# EAGLE design LB_BIT_o6_BUZZER-v02(rev1) (EAGLE 6.6.0)
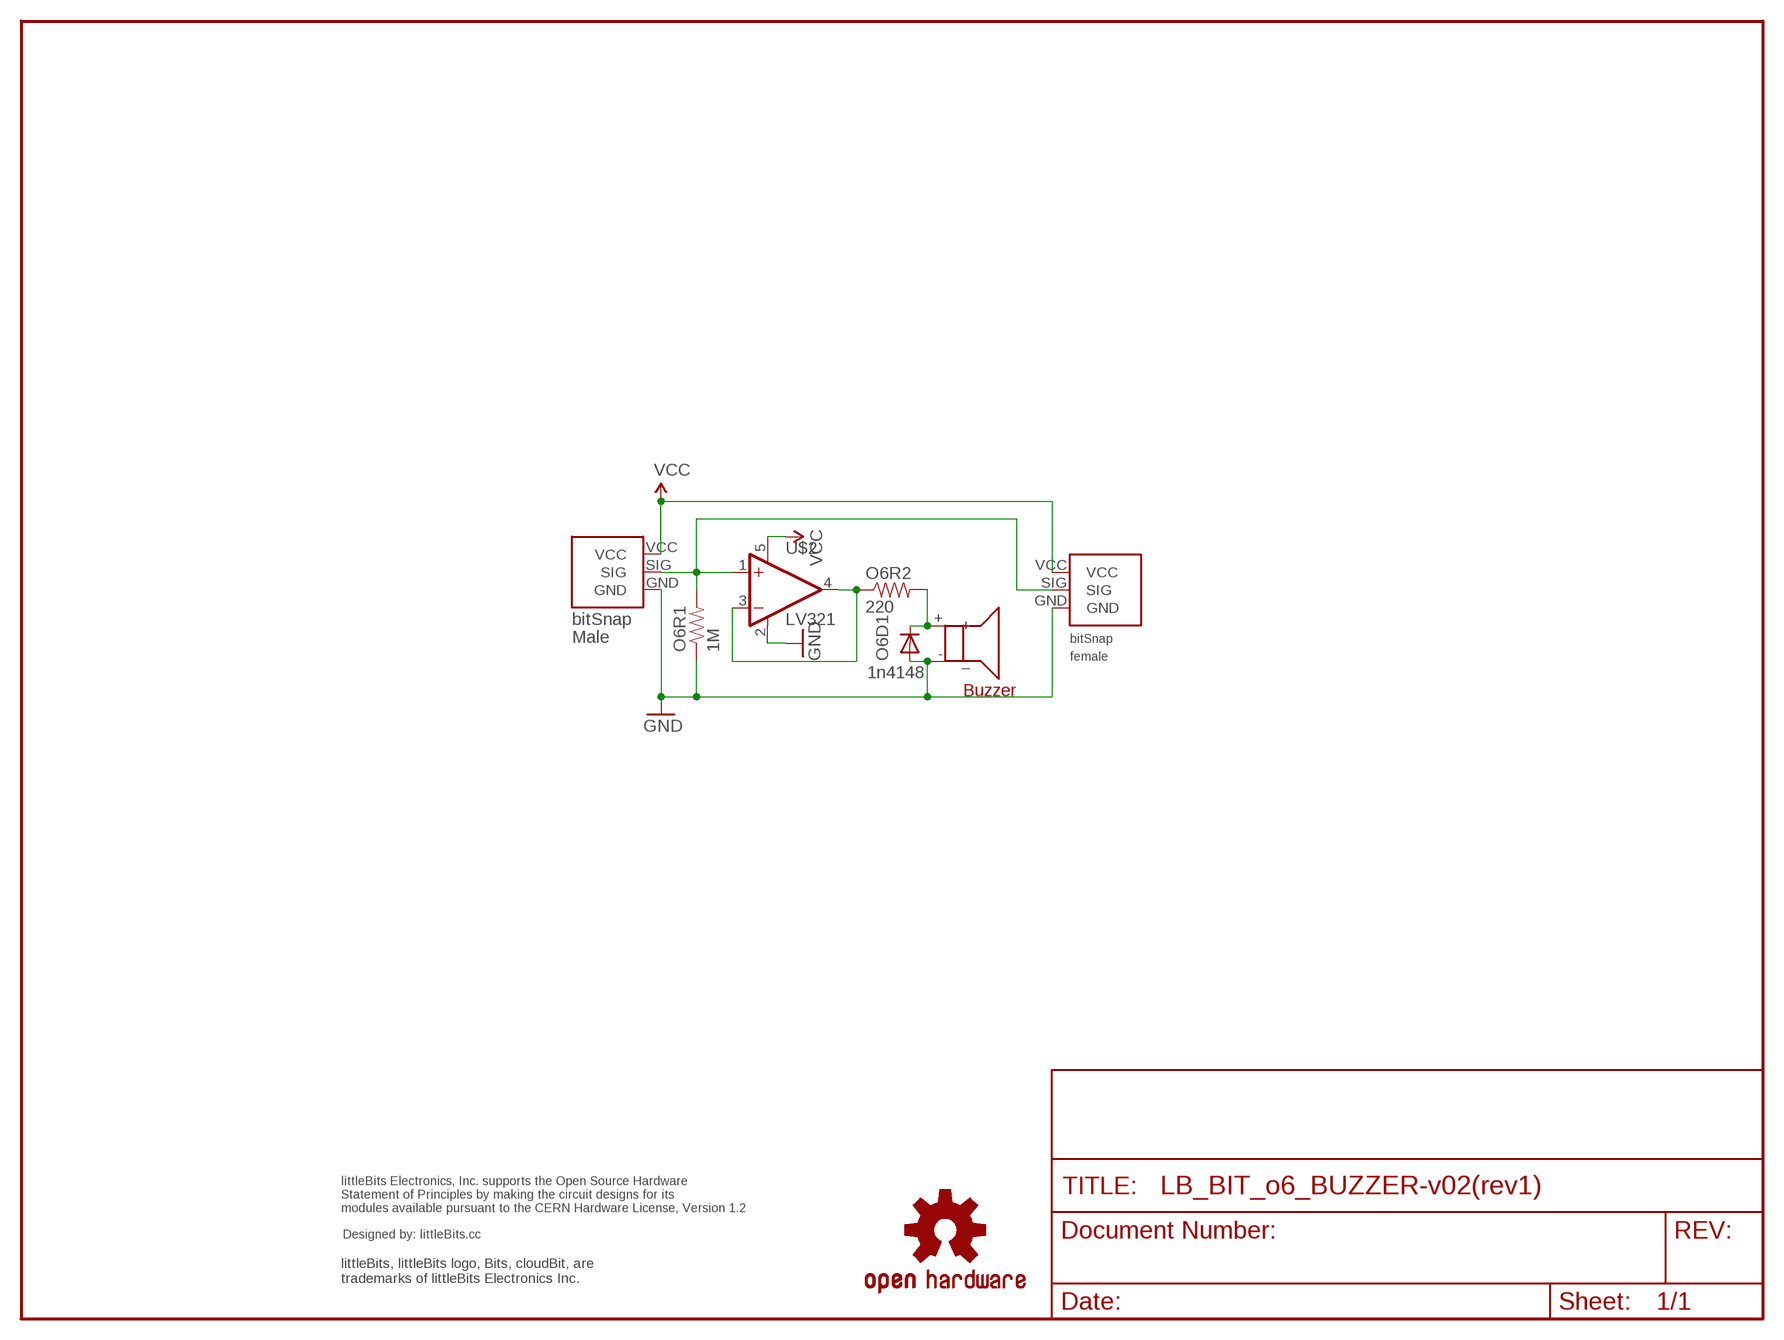
[diagram p0: schematic, sheet 1]

## Parts
O6BSF  BITSNAP_FEMALE  [BITSNAP_FEMALE]
O6BSM  BITSNAP_MALE  [BITSNAP_MALE]
O6D1  1n4148  DIODESOD  [SOD-323]
O6R1  1M  RESISTOR0603-RES  [0603-RES]
O6R2  220  RESISTOR0603-RES  [0603-RES]
O6U1  BUZZER-JSH2317AT  [BUZZER-JSH2317AT]
U$1  OSHWCREDIT  [OSHWCREDIT]
U$2  LV321  [SC70-5]
U$16  OSHW-LOGOL  [OSHW-LOGO-L]

## Nets
GND: O6BSF.GND O6BSM.GND O6D1.2(A) O6R1.1 O6U1.-(_) U$2.2(V-)
N$2: O6D1.1(C) O6R2.2 O6U1.+
N$6: O6BSF.SIG O6BSM.SIG O6R1.2 U$2.1(+IN)
N$8: O6R2.1 U$2.3(-IN) U$2.4(OUT)
VCC: O6BSF.VCC O6BSM.VCC U$2.5(V+)

## Library data of the parts
O6BSF = bitSnap:BITSNAP_FEMALE
O6BSM = bitSnap:BITSNAP_MALE
O6D1 = LITTLEBITS:DIODE: Diode These are standard reverse protection diodes and small signal diodes. SMA package can handle up to about 1A. SOD-323 can handle about 200mA. What the SOD-323 package when ordering, there are some mfgs out there that are 5-pin packages.
O6R1 O6R2 = SparkFun:RESISTOR: Resistor Basic schematic elements and footprints for 0603, 1206, and PTH 1/10th watt (small) resistors.
O6U1 = LITTLEBITS:BUZZER-JSH2317AT
U$1 = LITTLEBITS:OSHWCREDIT
U$2 = LITTLEBITS:LV321
U$16 = SparkFun_NEW:OSHW-LOGO: Open Source Hardware Logo This logo indicates the piece of hardware it is found on incorporates a OSHW license and/or adheres to the definition of open source hardware found here: http://freedomdefined.org/OSHW

## Board
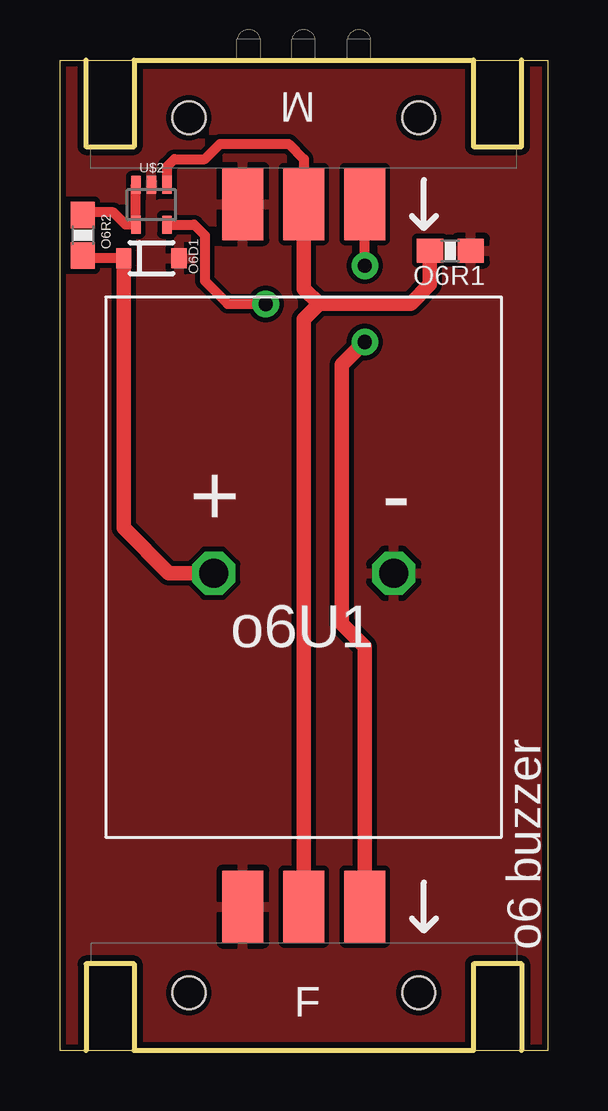
[diagram p1: board, top side]
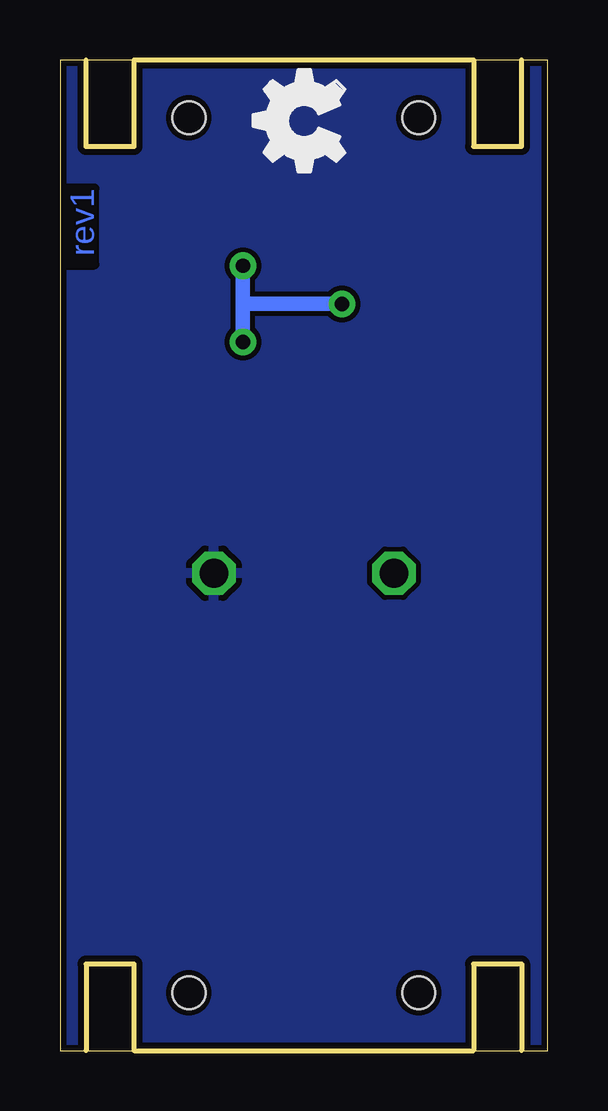
[diagram p2: board, bottom side, seen from below]

Size 20.32 x 41.27 mm. Coordinates in mm from the lower left corner, seen from the top.
Outline: 0,0 0,41.27 20.32,41.27 20.32,0 0,0
Copper layers (1*16): Top 0.035mm / dielectric 1.5mm / Bottom 0.035mm
Design rules "default": minimum track width 8mil, minimum drill 20mil, track to track 8mil, track to pad 8mil, pad to pad 8mil, via to via 8mil, smd to smd 8mil, copper to edge 10mil, drill to drill 8mil, minimum pad ring 12mil, minimum via ring 10mil, stop-mask expansion 4mil, vias tented up to drill 25mil, thermal gap 10mil

### Footprints (pad centres in the part's own frame; a part is rotated, then mirrored left to right if it is on the bottom)
BITSNAP_FEMALE = smd 1.7 x 3: GND 6.35,6; SIG 8.89,6; VCC 11.43,6 | hole 1.37: 13.68,2.41; 4.1,2.41
BITSNAP_MALE = smd 1.7 x 3: GND 11.43,6; SIG 8.89,6; VCC 6.35,6 | hole 1.37: 13.68,2.41; 4.1,2.41
SOD-323 = smd 0.63 x 0.83: 1 -1.15,0; 2 1.15,0
0603-RES = smd 1.1 x 1: 1 -0.85,0; 2 0.85,0
BUZZER-JSH2317AT = drill 1.2 octagon: + 4.5,11; - 12,11
SC70-5 = smd 0.4 x 0.75: 1 -0.65,-0.825; 2 0,-0.825; 3 0.65,-0.825; 4 0.65,0.825; 5 -0.65,0.825

### Placement (x,y rotation side)
O6BSF  1.27,0 0 top
O6BSM  19.05,41.27 180 top
O6D1  3.81,33.02 0 top
O6R1  16.27,33.33 180 top
O6R2  0.95,33.97 270 top
O6U1  1.91,8.89 0 top
U$1  -17,-21.7 0 top  (outside the outline)
U$2  3.81,35.24 180 top
U$7  [OSHW_FILLX150_NOTEXT]  8.46,35.79 0 top
U$16  -12.7,-10.16 0 top  (outside the outline)

### Tracks (layer width: path | path; a pad name or v marks a point on that pad's centre or on a via)
GND
  pour Top: 0.32,40.96 20,40.96 20,0.32 0.32,0.32
  pour Bottom: 0.32,40.96 20,40.96 20,0.32 0.32,0.32
N$2
  Top 0.406: O6D1.1 1.05,33.02 O6R2.2
  Top 0.61: O6D1.1 2.66,21.79 4.54,19.89 6.07,19.89 O6U1.+
N$6
  Top 0.406: U$2.1 4.46,36.84 4.76,37.15 6.03,37.15 6.67,37.78 9.53,37.78 10.16,37.15 O6BSM.SIG
  Top 0.61: O6R1.2 15.41,31.93 14.61,31.11 10.79,31.11 | 10.79,31.11 10.16,31.75 O6BSM.SIG | O6BSF.SIG 10.16,30.48 10.79,31.11
N$8
  Top 0.406: O6R2.1 0.95,34.92 2.22,34.92 2.73,34.42 U$2.4 U$2.3
VCC  (via drill 0.6)
  Top 0.406: U$2.5 5.59,34.42 6.03,33.97 6.03,32.07 6.99,31.11 v8.57,31.11 | v12.7,32.7 O6BSM.VCC
  Top 0.61: O6BSF.VCC 12.7,16.83 11.75,17.78 11.75,28.57 v12.7,29.53
  Bottom 0.61: v8.57,31.11 12.7,31.11 | v12.7,29.53 12.7,31.11 | 12.7,31.11 v12.7,32.7

### Text on the board
Bottom: rev1
tPlace: o6 buzzer
tNames: o6U1